# Altium project LM298.PrjPcb
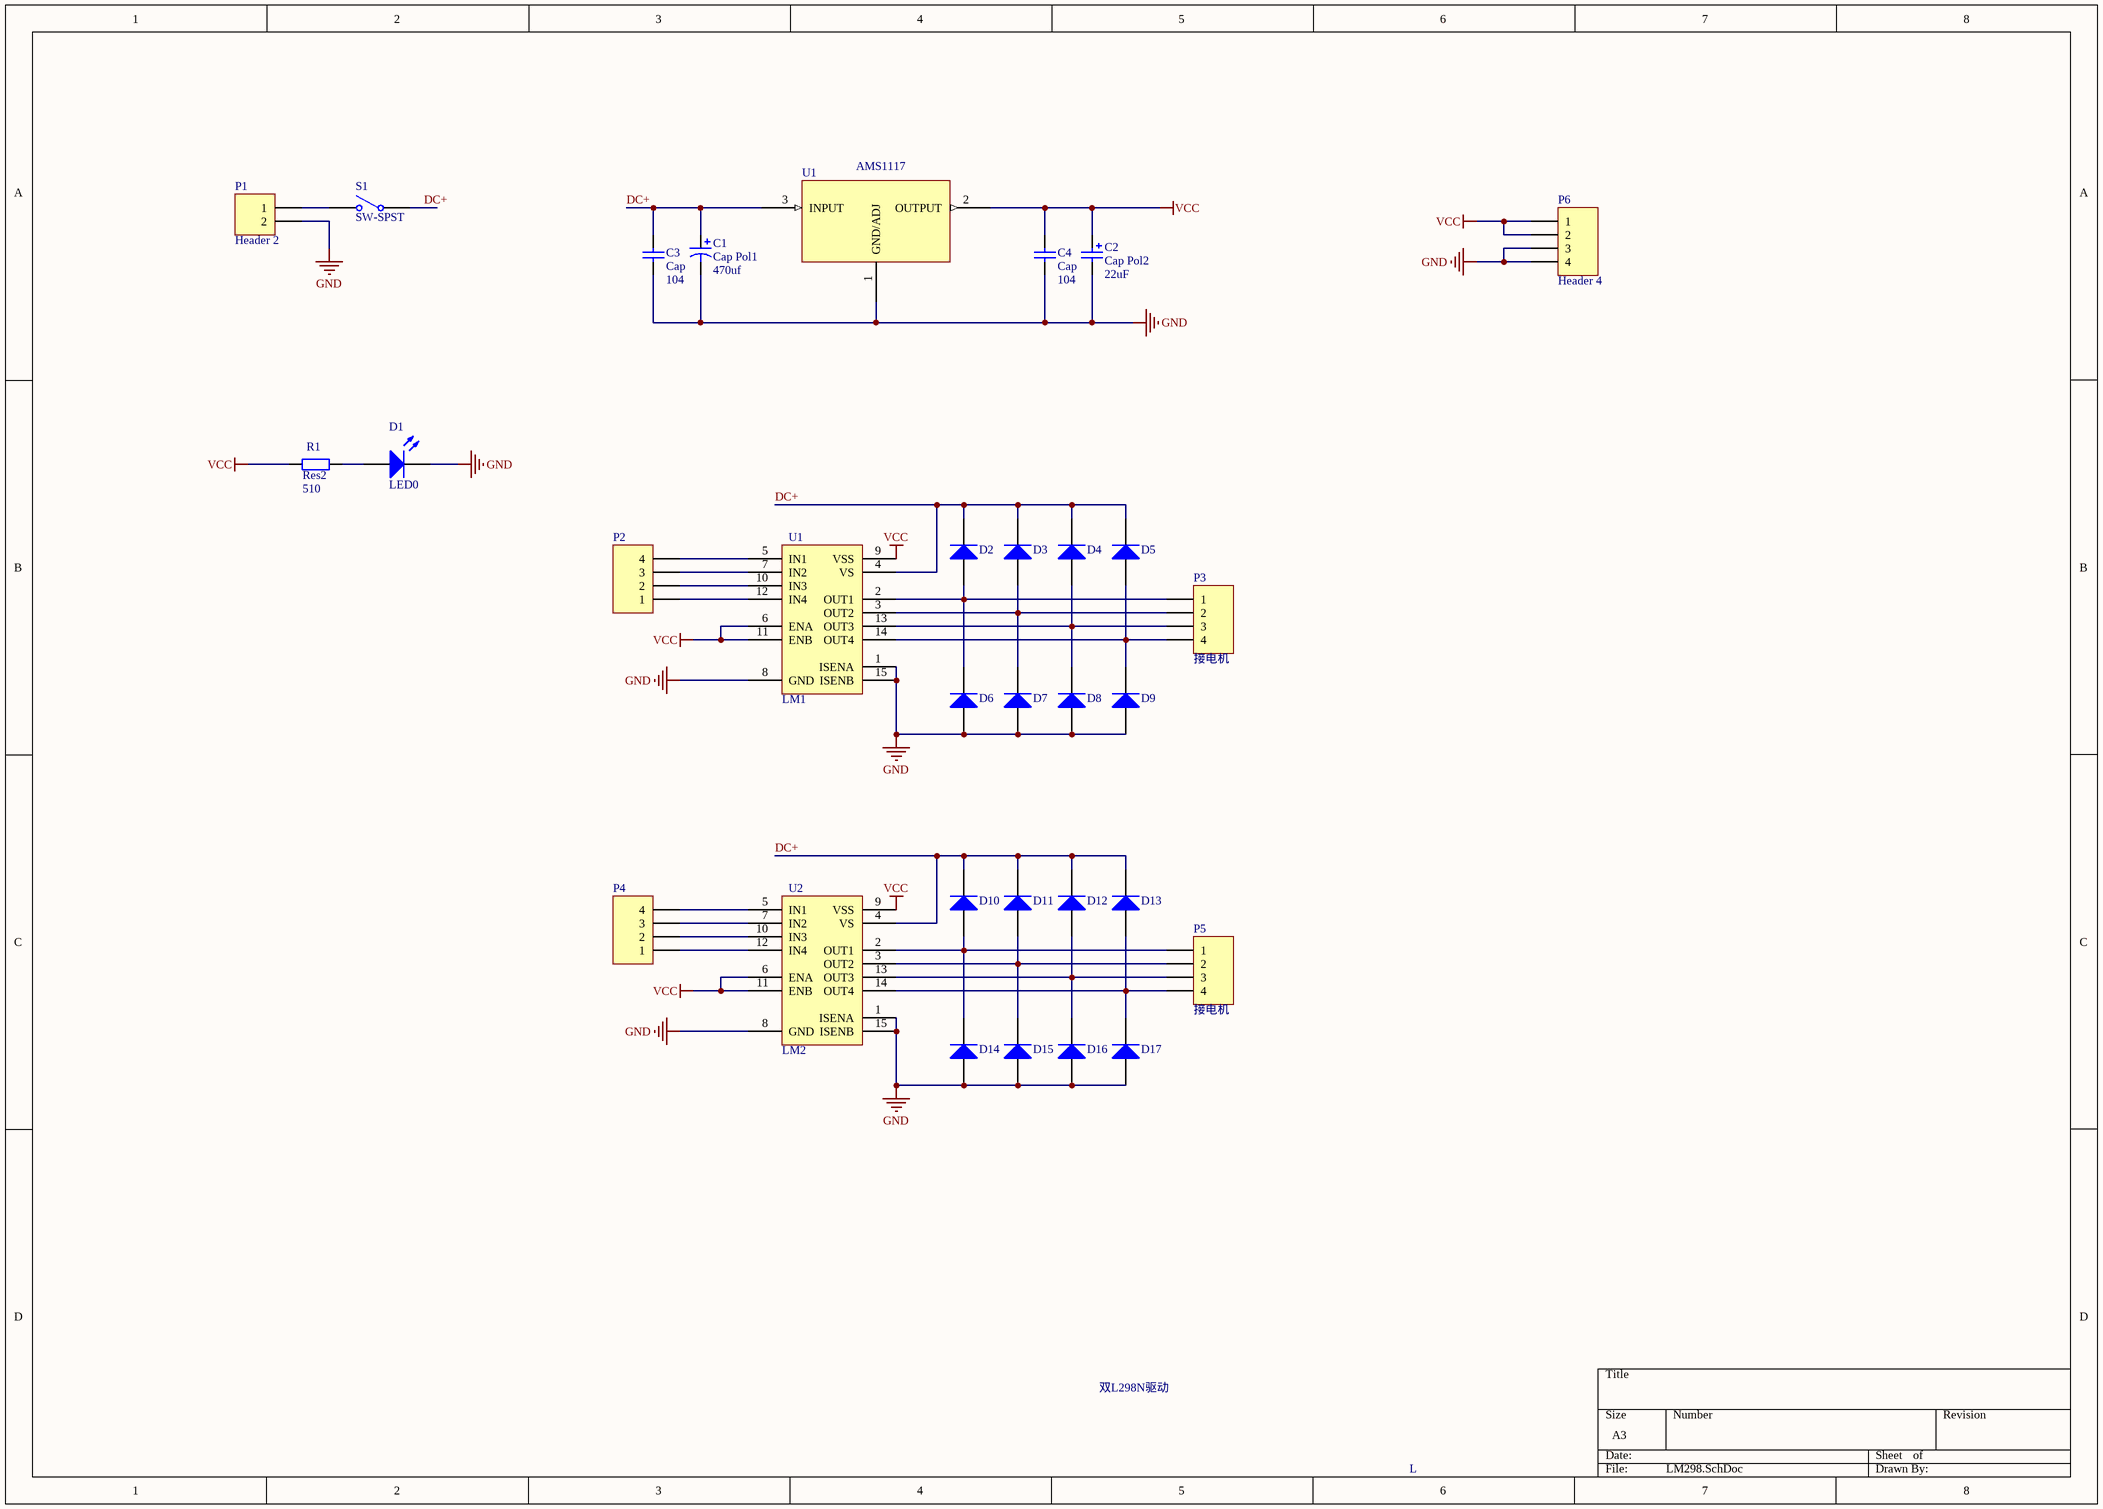
[diagram p0: LM298.SchDoc]
1 sheet, 32 parts. Net scope: global (net labels, ports and power ports of the same name join across sheets).
Board file: LM298N.PcbDoc

## Sheet LM298.SchDoc
size A3; PageSetup: Record=PageOptions|CenterHorizontal=True|CenterVertical=True|PrintScale=0.73|XCorrection=1.00|YCorrection=1.00|PrintKind=1|BorderSize=5000000|LeftOffset=0|BottomOffset=0|Orientation=2|PaperLength=1000|PaperWidth=1000|Scale=100|PaperSource=7|PrintQuality=-3|MediaType=1|DitherType=10|PrintScaleMode=1|PaperKind=A4|PaperIndex=9

### Parts
C1  Cap Pol1  value 470uf  [CAP-E1]
C2  Cap Pol2  value 22uF  [C-RB-8]
C3  Cap  value 104  [C-0805]
C4  Cap  value 104  [C-0805]
D1  LED0  [LED]
D2  Diode 1N4007  [DIODE-AXL]  (value not drawn)
D3  Diode 1N4007  [DIODE-AXL]  (value not drawn)
D4  Diode 1N4007  [DIODE-AXL]  (value not drawn)
D5  Diode 1N4007  [DIODE-AXL]  (value not drawn)
D6  Diode 1N4007  [DIODE-AXL]  (value not drawn)
D7  Diode 1N4007  [DIODE-AXL]  (value not drawn)
D8  Diode 1N4007  [DIODE-AXL]  (value not drawn)
D9  Diode 1N4007  [DIODE-AXL]  (value not drawn)
D10  Diode 1N4007  [DIODE-AXL]  (value not drawn)
D11  Diode 1N4007  [DIODE-AXL]  (value not drawn)
D12  Diode 1N4007  [DIODE-AXL]  (value not drawn)
D13  Diode 1N4007  [DIODE-AXL]  (value not drawn)
D14  Diode 1N4007  [DIODE-AXL]  (value not drawn)
D15  Diode 1N4007  [DIODE-AXL]  (value not drawn)
D16  Diode 1N4007  [DIODE-AXL]  (value not drawn)
D17  Diode 1N4007  [DIODE-AXL]  (value not drawn)
LM1  U1  [L298N]
LM2  U2  [L298N]
P1  Header 2  [接线柱]
P2  (no value)  [HDR1X4]
P3  接电机  [HDR1X4]
P4  (no value)  [HDR1X4]
P5  接电机  [HDR1X4]
P6  Header 4  [HDR1X4]
R1  Res2  value 510  [0805]
S1  SW-SPST  [SW-6pin]
U1  AMS1117  [AMS1117]

### Nets
GND: C1.2 C2.2 C3.2 C4.2 D1.2(K) D6.1(A) D7.1(A) D8.1(A) D9.1(A) D14.1(A) D15.1(A) D16.1(A) D17.1(A) LM1.1(ISENA) LM1.8(GND) LM1.15(ISENB) LM2.1(ISENA) LM2.8(GND) LM2.15(ISENB) P1.2 P6.3 P6.4 U1.1(GND/ADJ)
VCC: C2.1 C4.1 LM1.6(ENA) LM1.9(VSS) LM1.11(ENB) LM2.6(ENA) LM2.9(VSS) LM2.11(ENB) P6.1 P6.2 R1.1 U1.2(OUTPUT)
DC+: C1.1 C3.1 D2.2(K) D3.2(K) D4.2(K) D5.2(K) D10.2(K) D11.2(K) D12.2(K) D13.2(K) LM1.4(VS) LM2.4(VS) S1.1(COMMON) U1.3(INPUT)
NetD1_1: D1.1(A) R1.2
NetD2_1: D2.1(A) D6.2(K) LM1.2(OUT1) P3.1
NetD3_1: D3.1(A) D7.2(K) LM1.3(OUT2) P3.2
NetD4_1: D4.1(A) D8.2(K) LM1.13(OUT3) P3.3
NetD5_1: D5.1(A) D9.2(K) LM1.14(OUT4) P3.4
NetD10_1: D10.1(A) D14.2(K) LM2.2(OUT1) P5.1
NetD11_1: D11.1(A) D15.2(K) LM2.3(OUT2) P5.2
NetD12_1: D12.1(A) D16.2(K) LM2.13(OUT3) P5.3
NetD13_1: D13.1(A) D17.2(K) LM2.14(OUT4) P5.4
NetLM1_5: LM1.5(IN1) P2.4
NetLM1_7: LM1.7(IN2) P2.3
NetLM1_10: LM1.10(IN3) P2.2
NetLM1_12: LM1.12(IN4) P2.1
NetLM2_5: LM2.5(IN1) P4.4
NetLM2_7: LM2.7(IN2) P4.3
NetLM2_10: LM2.10(IN3) P4.2
NetLM2_12: LM2.12(IN4) P4.1
NetP1_1: P1.1 S1.2(NO)

### Notes on the sheet
- 双L298N驱动
- L

### Library data of the parts
C1 = Cap Pol1: Polarized Capacitor (Radial); Published: 8-Jun-2000; LatestRevisionDate: 17-Jul-2002; LatestRevisionNote: Re-released for DXP Platform.; PackageReference: RB7.6-15; Publisher: Altium Limited; PackageDescription: Polarized Capacitor (Radial); 2 Leads
C2 = Cap Pol2: Polarized Capacitor (Axial); Published: 8-Jun-2000; LatestRevisionDate: 17-Jul-2002; LatestRevisionNote: Re-released for DXP Platform.; PackageReference: POLAR0.8; Publisher: Altium Limited; PackageDescription: Polarized Capacitor; 2 Leads
C3 C4 = Cap: Capacitor; Published: 8-Jun-2000; LatestRevisionDate: 17-Jul-2002; LatestRevisionNote: Re-released for DXP Platform.; PackageReference: RAD-0.3; Publisher: Altium Limited; PackageDescription: Radial Cap, Thru-Hole; 2 Leads; 0.3 in Pin Spacing
D1 = LED0: Typical INFRARED GaAs LED; Published: 8-Jun-2000; LatestRevisionDate: 08-Jul-2005; LatestRevisionNote: Mech Layer 1 removed.; PackageReference: LED-0; Publisher: Altium Limited; PackageDescription: LED; 2 Leads
D2-D17 = Diode 1N4007: 1 Amp General Purpose Rectifier; Published: 8-Jun-2000; LatestRevisionDate: 17-Jul-2002; LatestRevisionNote: Re-released for DXP Platform.; DatasheetVersion: 1998; PackageVersion: Aug-1999; PackageReference: DO-41; Publisher: Altium Limited; PackageDescription: Diode, Axial; Body 5.2 x 2.7 mm (LxDia. max), Lead Dia. 0.86 mm (max); Code_JEDEC: DO-204-AL; ComponentLink1Description: Manufacturer Link; ComponentLink1URL: http://www.fairchildsemi.com/; ComponentLink2Description: Datasheet; ComponentLink2URL: http://www.fairchildsemi.com/ds/1N%2F1N4001.pdf
LM1 LM2 = LM2
P1 = Header 2: Header, 2-Pin; LatestRevisionDate: 17-Jul-2002; LatestRevisionNote: Re-released for DXP Platform.; Publisher: Altium Limited
P2-P6 = Header 4: Header, 4-Pin; LatestRevisionDate: 17-Jul-2002; LatestRevisionNote: Re-released for DXP Platform.; Publisher: Altium Limited
R1 = Res2: Resistor; Published: 8-Jun-2000; LatestRevisionDate: 17-Jul-2002; LatestRevisionNote: Re-released for DXP Platform.; PackageReference: AXIAL-0.4; Publisher: Altium Limited; PackageDescription: Axial Device, Thru-Hole; 2 Leads; 0.4 in Pin Spacing
S1 = SW-SPST: Single-Pole, Single-Throw Switch; Published: 24-Mar-1999; LatestRevisionDate: 17-Jul-2002; LatestRevisionNote: Re-released for DXP Platform.; PackageReference: SPST-2; Publisher: Altium Limited; PackageDescription: Switch; 2 Leads